# Altium project STM32F103C8T6 Blue Pill.PrjPcb
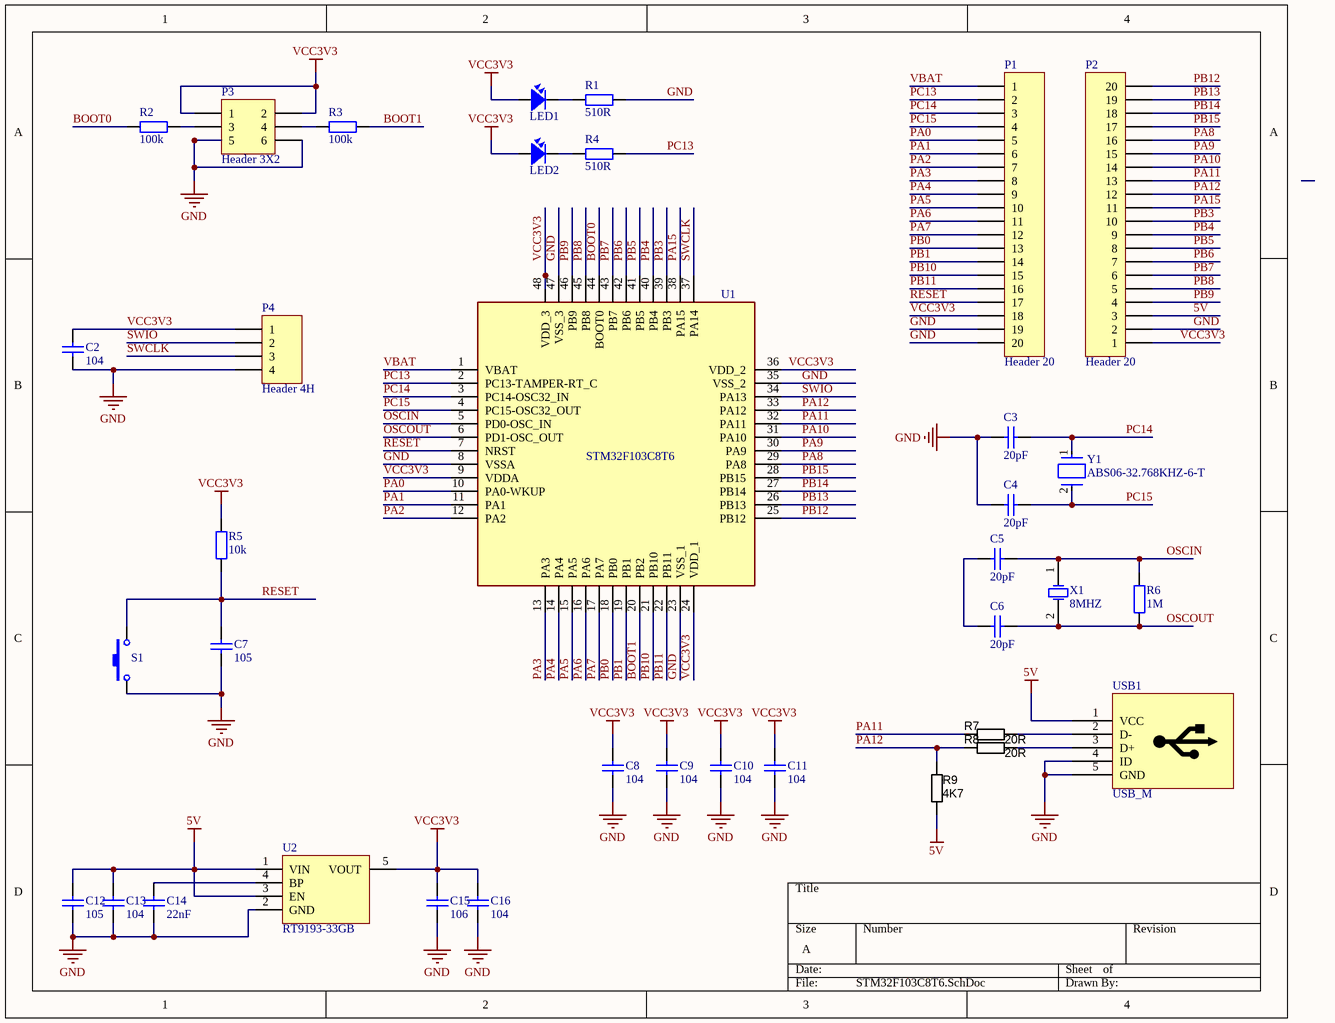
[diagram p0: STM32F103C8T6.SchDoc]
1 sheet, 36 parts. Net scope: global (net labels, ports and power ports of the same name join across sheets).
Board file: STM32F103C8T6 Blue Pill.PcbDoc

## Sheet STM32F103C8T6.SchDoc
size A; SheetNumber: 1; SheetTotal: 1

### Parts
C2  104  [tu 0603]
C3  20pF  [tu 0805]
C4  20pF  [tu 0805]
C5  20pF  [tu 0805]
C6  20pF  [tu 0805]
C7  105  [tu 0603]
C8  104  [tu 0603]
C9  104  [tu 0603]
C10  104  [tu 0603]
C11  104  [tu 0603]
C12  105  [tu 0805]
C13  104  [tu 0603]
C14  22nF  [tu 0805]
C15  106  [tu 0603]
C16  104  [tu 0603]
LED1  LED SMD  [SM-LED-0805-Blue]  (value not drawn)
LED2  LED SMD  [SM-LED-0805-Blue]  (value not drawn)
P1  Header 20  [HDR1X20]
P2  Header 20  [HDR1X20]
P3  Header 3X2  [HDR2X3]
P4  Header 4H  [HDR1X4H]
R1  510R  [tro smd 0603]
R2  100k  [tro smd 0603]
R3  100k  [tro smd 0603]
R4  510R  [tro smd 0603]
R5  10k  [tro smd 0603]
R6  1M  [tro smd 0603]
R7  value 20R  [RESC3216N]  (hidden comment: Thick Film)
R8  value 20R  [RESC3216N]  (hidden comment: Thick Film)
R9  value 4K7  [RESC1608N]  (hidden comment: Thick Film)
S1  SW-SMD  [SW-SMD]  (value not drawn)
U1  STM32F103C8T6  [LQFP-48_19.6_393_58X11_SMD]
U2  RT9193-33GB  [SOT23-5]
USB1  USB_M  [USB_B_MINI_SMD]
X1  8MHZ  [ABRA-ABLS-14.7456MHZ-B2-T_V]
Y1  ABS06-32.768KHZ-6-T  [FP-ABS06-MFG]

### Nets
5V: C12.1 C13.1 P2.3 R9.2 U2.1(VIN) U2.3(EN) USB1.1(VCC)
GND: C2.2 C3.2 C4.2 C7.2 C8.2 C9.2 C10.2 C11.2 C12.2 C13.2 C14.2 C15.2 C16.2 P1.19 P1.20 P2.2 P3.5 P3.6 P4.4 R1.2 S1.1 U1.8(VSSA) U1.23(VSS_1) U1.35(VSS_2) U1.47(VSS_3) U2.2(GND) USB1.4(ID) USB1.5(GND)
VCC3V3: C2.1 C8.1 C9.1 C10.1 C11.1 C15.1 C16.1 LED1.1 LED2.1 P1.18 P2.1 P3.1 P3.2 P4.1 R5.2 U1.9(VDDA) U1.24(VDD_1) U1.36(VDD_2) U1.48(VDD_3) U2.5(VOUT)
BOOT0: R2.1 U1.44(BOOT0)
BOOT1: R3.2 U1.20(PB2)
OSCIN: C5.1 R6.2 U1.5(PD0-OSC_IN) X1.1(X1)
OSCOUT: C6.1 R6.1 U1.6(PD1-OSC_OUT) X1.2(X2)
PA0: P1.5 U1.10(PA0-WKUP)
PA1: P1.6 U1.11(PA1)
PA2: P1.7 U1.12(PA2)
PA3: P1.8 U1.13(PA3)
PA4: P1.9 U1.14(PA4)
PA5: P1.10 U1.15(PA5)
PA6: P1.11 U1.16(PA6)
PA7: P1.12 U1.17(PA7)
PA8: P2.16 U1.29(PA8)
PA9: P2.15 U1.30(PA9)
PA10: P2.14 U1.31(PA10)
PA11: P2.13 R7.1 U1.32(PA11)
PA12: P2.12 R8.1 R9.1 U1.33(PA12)
PA15: P2.11 U1.38(PA15)
PB0: P1.13 U1.18(PB0)
PB1: P1.14 U1.19(PB1)
PB3: P2.10 U1.39(PB3)
PB4: P2.9 U1.40(PB4)
PB5: P2.8 U1.41(PB5)
PB6: P2.7 U1.42(PB6)
PB7: P2.6 U1.43(PB7)
PB8: P2.5 U1.45(PB8)
PB9: P2.4 U1.46(PB9)
PB10: P1.15 U1.21(PB10)
PB11: P1.16 U1.22(PB11)
PB12: P2.20 U1.25(PB12)
PB13: P2.19 U1.26(PB13)
PB14: P2.18 U1.27(PB14)
PB15: P2.17 U1.28(PB15)
PC13: P1.2 R4.2 U1.2(PC13-TAMPER-RT_C)
PC14: C3.1 P1.3 U1.3(PC14-OSC32_IN) Y1.1
PC15: C4.1 P1.4 U1.4(PC15-OSC32_OUT) Y1.2
RESET: C7.1 P1.17 R5.1 S1.2 U1.7(NRST)
SWCLK: P4.3 U1.37(PA14)
SWIO: P4.2 U1.34(PA13)
VBAT: P1.1 U1.1(VBAT)
NetC5_2: C5.2 C6.2
NetC14_1: C14.1 U2.4(BP)
NetLED1_2: LED1.2 R1.1
NetLED2_2: LED2.2 R4.1
NetP3_3: P3.3 R2.2
NetP3_4: P3.4 R3.1
NetR7_2: R7.2 USB1.2(D-)
NetR8_2: R8.2 USB1.3(D+)

### Library data of the parts
C2 C8-C11 C13 C16 = Tu 0603 104 50V 10%: Dán; Don_Vi: Con; So_Chan: 2; Ten_Linh_Kien: Tụ 0603 104-100nF 10% 50V; Ma_Hang: MH004568; Chung_Loai: Dán; Kieu_Chan: *
C3-C6 = Tu 0805 20pF 50V 10%: Dán; Don_Vi: Con; Ten_Linh_Kien: Tụ 0805 20P 10% 50V; So_Chan: 2; Ma_Hang: MH004558; Chung_Loai: Dán; Kieu_Chan: *
C7 = Tu 0603 105 16V 20%: Dán; Don_Vi: Con; So_Chan: 2; Ten_Linh_Kien: Tụ 0603 105-1uF 20% 16V; Ma_Hang: MH004574; Chung_Loai: Dán; Kieu_Chan: *
C12 = Tu 0805 105 50V 10%: Dán; Don_Vi: Con; So_Chan: 2; Ten_Linh_Kien: Tụ 0805 105-1uF 10% 50V; Ma_Hang: MH004552; Chung_Loai: Dán; Kieu_Chan: *
C14 = Tu 0805 22nF 50V 20%: Dán; Don_Vi: Con; So_Chan: 2; Ten_Linh_Kien: Tụ 0805 22nF 50V 20%; Ma_Hang: MH007857; Chung_Loai: Dán; Kieu_Chan: *
C15 = Tu 0603 106 16V 20%: Dán; Don_Vi: Con; So_Chan: 2; Ten_Linh_Kien: Tụ 0603-10uF 20% 16V; Ma_Hang: MH004848; Chung_Loai: Dán; Kieu_Chan: *
LED1 LED2 = LED-SMD-0805
P1 P2 = Header 20: Header, 20-Pin; LatestRevisionDate: 17-Jul-2002; LatestRevisionNote: Re-released for DXP Platform.; Publisher: Altium Limited
P3 = Header 3X2: Header, 3-Pin, Dual row; LatestRevisionDate: 17-Jul-2002; LatestRevisionNote: Re-released for DXP Platform.; Publisher: Altium Limited
P4 = Header 4H: Header, 4-Pin, Right Angle; LatestRevisionDate: 17-Jul-2002; LatestRevisionNote: Re-released for DXP Platform.; Publisher: Altium Limited
R1 R4 = Tro 0603 5% 510R: Dán; Don_Vi: Con; So_Chan: 2; Ten_Linh_Kien: Trở 0603 5% 510R; Ma_Hang: MH007667; Chung_Loai: Dán; Kieu_Chan: *
R2 R3 = Tro 0603 5% 100k: Dán; So_Chan: 2; Ten_Linh_Kien: Trở 0603 5% 100k; Ma_Hang: MH006314; Don_Vi: Con; Chung_Loai: Dán; Kieu_Chan: *
R5 = Tro 0603 1% 10k: Dán; Don_Vi: Con; So_Chan: 2; Ten_Linh_Kien: Trở 0603 1% 10k; Ma_Hang: MH006333; Chung_Loai: Dán; Kieu_Chan: *
R6 = Tro 0603 5% 1M: Dán; Don_Vi: Con; So_Chan: 2; Ten_Linh_Kien: Trở 0603 5% 1M; Ma_Hang: MH006909; Chung_Loai: Dán; Kieu_Chan: *
R7 R8 = RES_20R_1206_5%: Resistor SMD chip 20 Ohm 0.25W 5% 1206; Manufacturer 1: Yageo; Manufacturer Part Number 1: RC1206JR-0720RL; Ratings: 1/4W; Package / Case: 1206 (3216 metric); Tolerance: ±5%; Supplier 1: Digi-Key; Supplier Part Number 1: 311-20ERCT-ND
R9 = RES_4K7_0603_5%: Resistor SMD chip 4.7k Ohm 0.1W 5% 0603; Manufacturer 1: Vishay/Dale; Manufacturer Part Number 1: CRCW06034K70JNEA; Ratings: 1/10 W; Package / Case: 0603 (1608 metric); Tolerance: ±5%; Material: Thick Film; Supplier 1: Digi-Key; Supplier Part Number 1: 541-4.7KGCT-ND
S1 = SW-SMD: Switch; Published: 24-Mar-1999; LatestRevisionDate: 17-Jul-2002; LatestRevisionNote: Re-released for DXP Platform.; PackageReference: SPST-2; Publisher: Altium Limited
U1 = IC_STM32F103C8T6: ARM® Cortex®-M3 STM32F1 Microcontroller IC 32-Bit 72MHz 64KB (64K x 8) FLASH 48-LQFP (7x7); Manufacturer: STMicroelectronics; Alternate Part Number-1: NA; Manufacturer Part Number: STM32F103C8T6; Case/Package: LQFP48; Supplier-1: LCSC; Supplier Part Number-1: STM32F103C8T6
U2 = REG_5.5V-3.3V-0.3A-1W-SOT-23-5: Linear Voltage Regulator IC 1 Output 300mA SOT-23-5; Manufacturer: Richtek USA Inc.; Alternate Part Number-1: NA; Manufacturer Part Number: RT9193-33GB; Supplier-1: LCSC; Supplier Part Number-1: C15651; Case/Package: SOT-23-5
X1 = CMP-2000-05726-1: Low Profile Crystal, 8.0 MHz, +/- 30 ppm, -20 to 70 degC, 2-Pin SMD, RoHS, Tape and Reel; Brand: ABRACON; Case Length: 11.4mm; Frequency Stability: 50PPM; ESR: 80Ohms; Case Height: 4.2mm; Tolerance: 30PPM; Case Width: 4.7mm; Load Capacitance: 18pF; Datasheet Version: 04/2011; Termination Style: SMD/SMT; Dimensions: 4.7mmWx11.4mmLx4.2mmH; Packaging: Reel; Manufacturer: ABRACON; Package URL: http://www.abracon.com/Support/PackageDrawing/Resonators/ABLS-2D.pdf; Mounting Technology: SurfaceMount; Package Reference: ABLS-14.7456MHZ-B2-T; Product Category: Crystals; Package Description: 2-Pin Surface Mount Device, Body 11.4 x 4.7 mm; Package / Case: HC-49/US; Mounting Style: SMD/SMT; Operating Temperature Range: -20Cto+70C; Series: ABLS; Frequency: 8MHz; Factory Pack Quantity: 1000; Datasheet URL: http://www.abracon.com/Resonators/abls.pdf; Manufacturer URL: http://www.abracon.com/; RoHS: Details; Type: LowProfileMicroprocessorCrystal
Y1 = CMP-27762-015510-1: Crystal 32.768kHz ±20ppm (Tol) 6pF FUND 90kΩ 2-Pin Mini-CSMD T/R; Series Resistance: 90kR; Radiation Hardening: No; Frequency: 32.768kHz; Width: 0.047inch; Max Operating Temperature: 85°C; Load Capacitance: 6pF; Packaging: Tape and Reel; Mount: Surface Mount; Case/Package: SMD/SMT; Length: 0.079inch; Frequency Tolerance: 20ppm; Number of Pins: 2; Series: ABS06; ESR (Equivalent Series Resistance): 90kR; Height: 0.024inch; Min Operating Temperature: -40°C; RoHS Compliant: Yes